# Altium schematic sheet 大创_电机驱动板原理图2_MCU部分.SchDoc
size A4
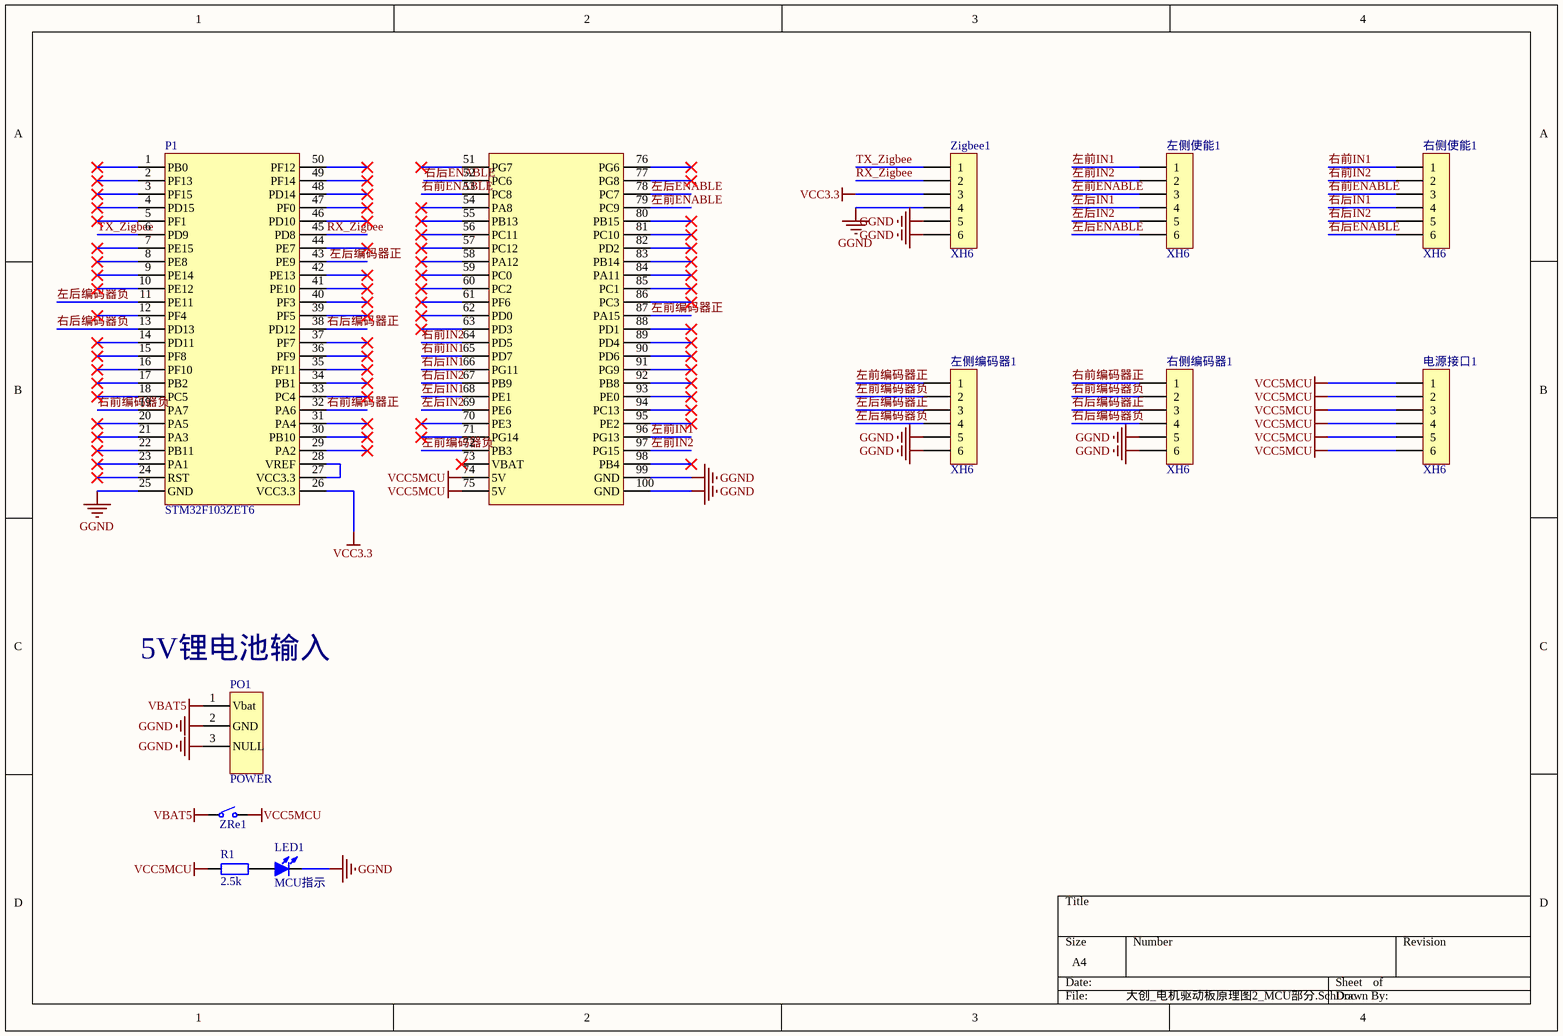
[diagram p0: 大创_电机驱动板原理图2_MCU部分.SchDoc]

## Parts
LED1  MCU指示  [LED 0805R]
P1  STM32F103ZET6  [主控STM32F103ZET6]
PO1  POWER  [DC-050-5.5*2.1_贴片]
R1  2.5k  [R 0805_M]
Zigbee1  XH6  [XH6/2.54mm/180]
ZRe1  ZigReset  [蓝色拨码开关_1p]  (value not drawn)
右侧使能1  XH6  [XH6/2.54mm/180]
右侧编码器1  XH6  [XH6/2.54mm/180]
左侧使能1  XH6  [XH6/2.54mm/180]
左侧编码器1  XH6  [XH6/2.54mm/180]
电源接口1  XH6  [XH6/2.54mm/180]

## Nets
GGND: LED1.2(K) P1.25(GND) P1.99(GND) P1.100(GND) PO1.2(GND) PO1.3(NULL) Zigbee1.4 Zigbee1.5 Zigbee1.6 右侧编码器1.5 右侧编码器1.6 左侧编码器1.5 左侧编码器1.6
VBAT5: PO1.1(Vbat) ZRe1.1
VCC3.3: P1.26(VCC3.3) Zigbee1.3
VCC5MCU: P1.74(5V) P1.75(5V) R1.2 ZRe1.2 电源接口1.1 电源接口1.2 电源接口1.3 电源接口1.4 电源接口1.5 电源接口1.6
RX_Zigbee: P1.45(PD8) Zigbee1.2
TX_Zigbee: P1.6(PD9) Zigbee1.1
右前ENABLE: P1.53(PC8) 右侧使能1.3
右前IN1: P1.65(PD7) 右侧使能1.1
右前IN2: P1.64(PD5) 右侧使能1.2
右前编码器正: P1.32(PA6) 右侧编码器1.1
右前编码器负: P1.19(PA7) 右侧编码器1.2
右后ENABLE: P1.52(PC6) 右侧使能1.6
右后IN1: P1.66(PG11) 右侧使能1.4
右后IN2: P1.67(PB9) 右侧使能1.5
右后编码器正: P1.38(PD12) 右侧编码器1.3
右后编码器负: P1.13(PD13) 右侧编码器1.4
左前ENABLE: P1.79(PC9) 左侧使能1.3
左前IN1: P1.96(PG13) 左侧使能1.1
左前IN2: P1.97(PG15) 左侧使能1.2
左前编码器正: P1.87(PA15) 左侧编码器1.1
左前编码器负: P1.72(PB3) 左侧编码器1.2
左后ENABLE: P1.78(PC7) 左侧使能1.6
左后IN1: P1.68(PE1) 左侧使能1.4
左后IN2: P1.69(PE6) 左侧使能1.5
左后编码器正: P1.43(PE9) 左侧编码器1.3
左后编码器负: P1.11(PE11) 左侧编码器1.4
NetLED1_1: LED1.1(A) R1.1
NetP1_27: P1.27(VCC3.3) P1.28(VREF)

Not connected (* = marked no-connect by the designer): P1 1(PB0)* 2(PF13)* 3(PF15)* 4(PD15)* 5(PF1)* 7(PE15)* 8(PE8)* 9(PE14)* 10(PE12)* 12(PF4)* 14(PD11)* 15(PF8)* 16(PF10)* 17(PB2)* 18(PC5)* 20(PA5)* 21(PA3)* 22(PB11)* 23(PA1)* 24(RST)* 29(PA2)* 30(PB10)* 31(PA4)* 33(PC4)* 34(PB1)* 35(PF11)* 36(PF9)* 37(PF7)* 39(PF5)* 40(PF3)* 41(PE10)* 42(PE13)* 44(PE7)* 46(PD10)* 47(PF0)* 48(PD14)* 49(PF14)* 50(PF12)* 51(PG7)* 54(PA8)* 55(PB13)* 56(PC11)* 57(PC12)* 58(PA12)* 59(PC0)* 60(PC2)* 61(PF6)* 62(PD0)* 63(PD3)* 70(PE3)* 71(PG14)* 73(VBAT)* 76(PG6)* 77(PG8)* 80(PB15)* 81(PC10)* 82(PD2)* 83(PB14)* 84(PA11)* 85(PC1)* 86(PC3)* 88(PD1)* 89(PD4)* 90(PD6)* 91(PG9)* 92(PB8)* 93(PE0)* 94(PC13)* 95(PE2)* 98(PB4)*

## Notes on the sheet
- (near PO1) 5V锂电池输入

## Library data of the parts
LED1 = LED-SMD: 贴片LED; 版权归属: 黎明电子style; BOM名称: 贴片LED; 学习资源: https://lmdzstyle.taobao.com/
P1 = STM32F103ZET6: 正电原子 STM32F103C8T6
R1 = R: 贴片电阻; 版权归属: 黎明电子style; BOM名称: 贴片电阻; 学习资源: https://lmdzstyle.taobao.com/
ZRe1 = TSW 3x6: 3x6轻触开关; 版权归属: 黎明电子style; BOM名称: 3x6轻触开关; 学习资源: https://lmdzstyle.taobao.com/